# Altium project WiCAN.PrjPcb
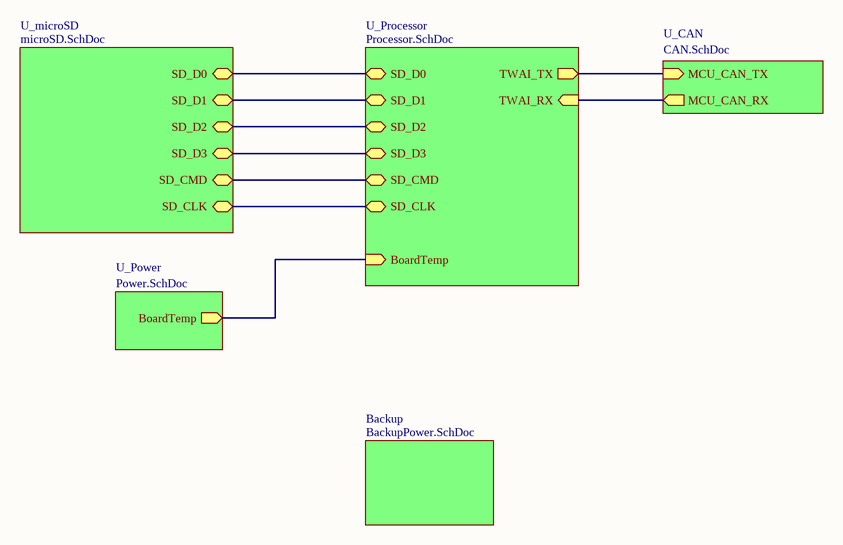
[diagram p0: WiCAN_master.SchDoc]
6 sheets, 95 parts. Net scope: hierarchical (ports join the sheet entries above them; power ports are global).
Board file: WiCAN_V2.PcbDoc
Sheets:
  WiCAN_master.SchDoc
    U_Processor = Processor.SchDoc
    U_Power = Power.SchDoc
    U_microSD = microSD.SchDoc
    U_CAN = CAN.SchDoc
    Backup = BackupPower.SchDoc

## Sheet WiCAN_master.SchDoc
size A4; SheetNumber: 1; SheetTotal: 6

### Sub-sheets
Backup = BackupPower.SchDoc: no entries
U_CAN = CAN.SchDoc: MCU_CAN_TX (in), MCU_CAN_RX (out)
U_microSD = microSD.SchDoc: SD_D0 (bidir), SD_D1 (bidir), SD_D2 (bidir), SD_D3 (bidir), SD_CMD (bidir), SD_CLK (bidir)
U_Power = Power.SchDoc: BoardTemp (out)
U_Processor = Processor.SchDoc: SD_D0 (bidir), SD_D1 (bidir), SD_D2 (bidir), SD_D3 (bidir), SD_CMD (bidir), SD_CLK (bidir), TWAI_TX (out), TWAI_RX (in), BoardTemp (in)

### Nets
MCU_Temp_In: sheet U_Processor/BoardTemp, sheet U_Power/BoardTemp
NetJ2_1: sheet U_Processor/SD_D2, sheet U_microSD/SD_D2
NetJ2_2: sheet U_Processor/SD_D3, sheet U_microSD/SD_D3
NetJ2_3: sheet U_Processor/SD_CMD, sheet U_microSD/SD_CMD
NetJ2_5: sheet U_Processor/SD_CLK, sheet U_microSD/SD_CLK
NetJ2_7: sheet U_Processor/SD_D0, sheet U_microSD/SD_D0
NetJ2_8: sheet U_Processor/SD_D1, sheet U_microSD/SD_D1
NetU1_20: sheet U_Processor/TWAI_TX, sheet U_CAN/MCU_CAN_TX
NetU1_21: sheet U_Processor/TWAI_RX, sheet U_CAN/MCU_CAN_RX

## Sheet Processor.SchDoc
size A4; SheetNumber: 2; SheetTotal: 6; SPICEModelCacheYJUROCZO: <root> / <DocumentId>YJUROCZO</DocumentId> / <CacheFrame Number="0"> / <Model Name="umk107bj105_a-t" Kind="CKT"> / <Text>* UMK107BJ105_A-T     SPICE MODEL  ( General Type ) / *-------------------------------------------------------------------------------------------------------- / * Model Generated by TAIYO YUDEN Corporation (http://www.ty-top.com) / * Version 1.0 / * TAIYO YUDEN Control No. 170508_130520 / * Copyright(c) 2012 TAIYO YUDEN CO.,LTD. All Rights Reserved. / *-------------------------------------------------------------------------------------------------------- / * / * Products Name : Multilayer Ceramic Capacitors / * / * Characteristics : / *     Capacitance : 1 uF , Rated Voltage : 50V , TCC : X5R / *     Case Size : 1.6 x 0.8 / 0.063 x 0.031 [mm/inch] , Thickness : 0.8 / 0.031 [mm/inch] / *     (Conditions: Temperature = 25 degC , DC Bias Current/Voltage = 0A / 0V) / * / * Frequency Range : 40Hz - 3GHz / * / * External Node Assignments : / * / *  1  o---| |---o  2 / * / *-------------------------------------------------------------------------------------------------------- / .SubCkt UMK107BJ105_A-T 1 2 / **************************** / C0 1 110 0.79929u / Cm 1 101 0.13681u / C1 101 102 0.26224u / Rc1 101 102 5.8806k / C2 102 103 0.057839u / Rc2 102 103 469.42 / C3 103 110 0.014568u / Rc3 103 110 14.853 / C2m 1 301 0.13283u / C21 301 302 1.2593u / Rc21 301 302 6.3079k / C22 302 303 1.1189u / Rc22 302 303 6.9405k / C23 303 304 1.1421u / Rc23 303 304 6.4848k / C24 304 305 0.36861u / Rc24 304 305 785 / C25 305 306 0.39327u / Rc25 305 306 637.41 / C26 306 307 0.27451u / Rc26 306 307 19.365 / C27 307 308 0.15295u / Rc27 307 308 23.239 / C28 308 309 0.17569u / Rc28 308 309 17.788 / C29 309 110 1420.6p / Rc29 309 110 1.9725 / Rp0 1 110 500Meg / L0 110 120 0.24088n / Lm 120 130 0.1369n / L1 120 121 0.1842n / RL1 121 130 0.29804 / L2 120 122 0.40657n / RL2 122 130 0.57395 / L3 120 123 0.85773n / RL3 123 130 0.82282 / CR 120 124 0.11463u / LR 124 125 0.25983n / RR 125 130 52.447m / CL 130 140 1.4637p / LL 130 140 0.23986n / RL 130 140 33.985 / Rs 140 2 6.8539m / **************************** / .ends UMK107BJ105_A-T</Text> / </Model> / </CacheFrame> / </root>
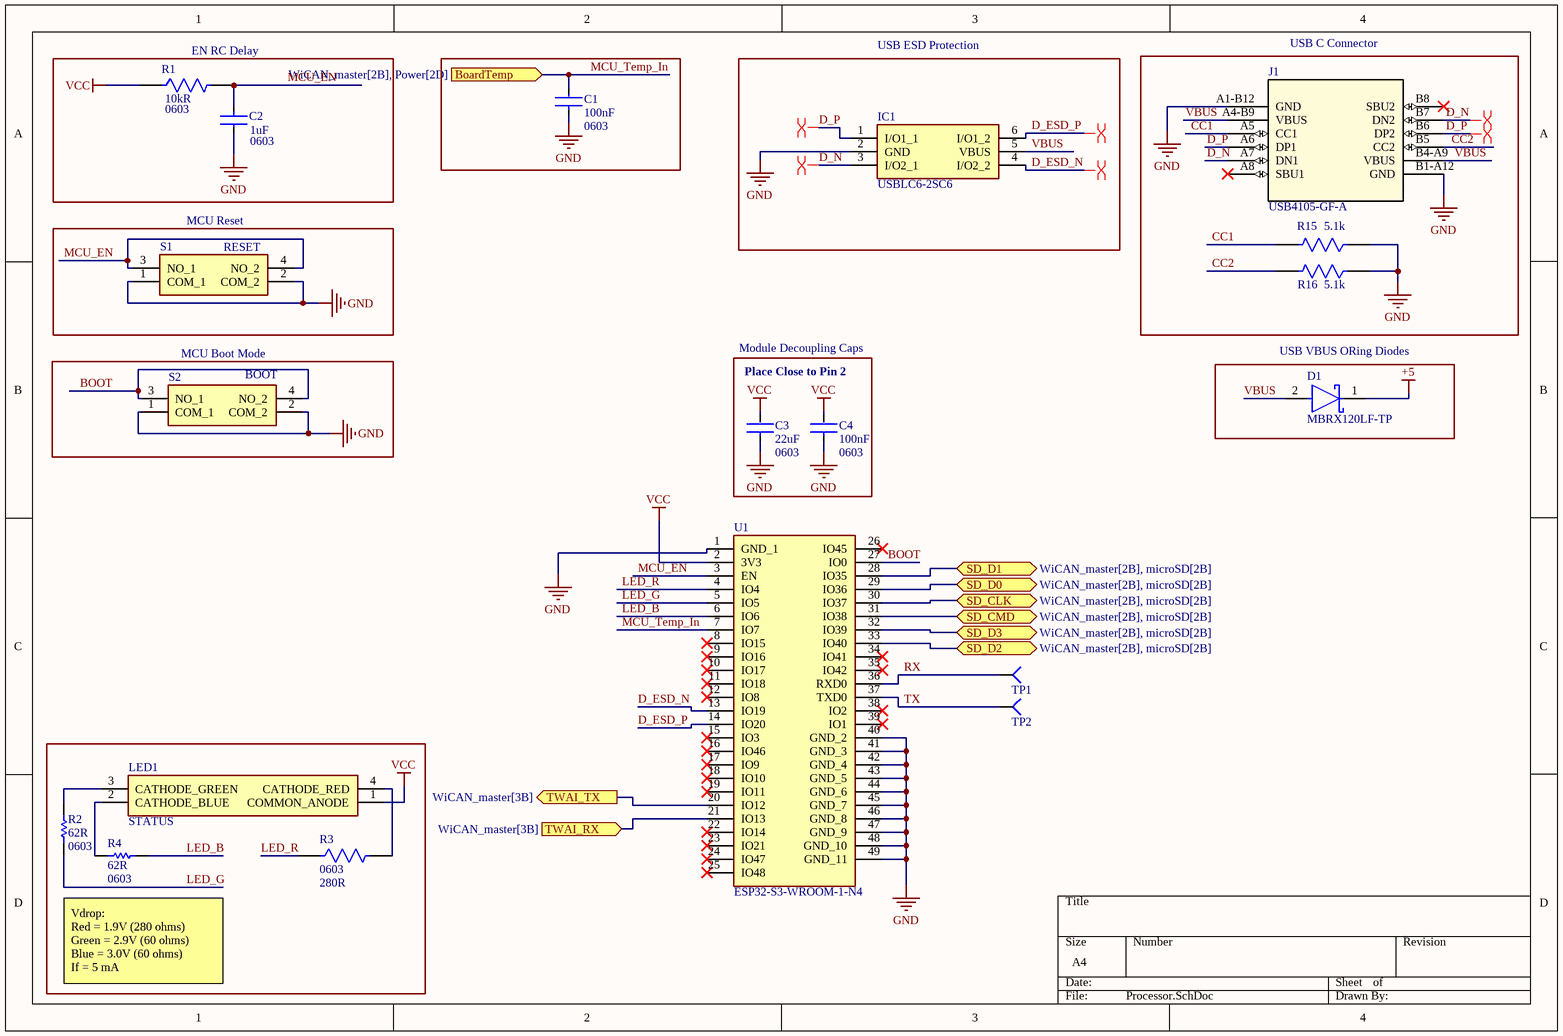
[diagram p1: Processor.SchDoc]

### Parts
C1  Capacitance: 100nF  Case/Package: 0603  [FP-CL10-IPC_A]  (hidden comment: CL10B104KB8WPNC)
C2  Case/Package: 0603  Capacitance: 1uF  [FP-0603-L_1_6_0_1-W_0_8_0-IPC_A]  (hidden comment: UMK107BJ105KA-T)
C3  Capacitance: 22uF  Case Code (Imperial): 0603  [FP-GRM188-0_2-IPC_C]  (hidden comment: GRM188R61A226ME15D)
C4  Capacitance: 100nF  Case/Package: 0603  [FP-CL10-IPC_A]  (hidden comment: CL10B104KB8WPNC)
D1  MBRX120LF-TP  [FP-SOD-123-IPC_A]
IC1  USBLC6-2SC6  [SOT95P280X145-6N]
J1  USB4105-GF-A  [USB4105_GCT]
LED1  STATUS  [CLMVCFKACL1D1L71BB7C3C3]
R1  Case Code (Imperial): 0603  Resistance: 10kR  [FP-RMCF0603-MFG]  (hidden comment: RMCF0603JG10K0)
R2  Resistance: 62R  Package: 0603  [RESC1608X55X30ML15T15]  (hidden comment: ERJ-3GEYJ620V)
R3  Case/Package: 0603  Resistance: 280R  [FP-RMCF0603-MFG]  (hidden comment: RMCF0603FT280R)
R4  Resistance: 62R  Package: 0603  [RESC1608X55X30ML15T15]  (hidden comment: ERJ-3GEYJ620V)
R15  Resistor: 5.1k  [FP-AC0603-MFG]  (hidden comment: AC0603FR-135K1L)
R16  Resistor: 5.1k  [FP-AC0603-MFG]  (hidden comment: AC0603FR-135K1L)
S1  RESET  [PTS526SM15SMTR2LFS]
S2  BOOT  [PTS526SM15SMTR2LFS]
TP1  RX  [TESTPOINT_CIRCLE_1MM]  (value not drawn)  (no BOM)
TP2  TX  [TESTPOINT_CIRCLE_1MM]  (value not drawn)  (no BOM)
U1  ESP32-S3-WROOM-1-N4  [ESP32S3WROOM1N4]

### Blocks framed on the sheet
EN RC Delay: C2 R1
USB ESD Protection: IC1
USB C Connector: J1 R15 R16
MCU Reset: S1
MCU Boot Mode: S2
USB VBUS ORing Diodes: D1

### Ports
BoardTemp (in, see WiCAN_master[2B], Power[2D]), SD_CLK (bidir, see WiCAN_master[2B], microSD[2B]), SD_CMD (bidir, see WiCAN_master[2B], microSD[2B]), SD_D0 (bidir, see WiCAN_master[2B], microSD[2B]), SD_D1 (bidir, see WiCAN_master[2B], microSD[2B]), SD_D2 (bidir, see WiCAN_master[2B], microSD[2B]), SD_D3 (bidir, see WiCAN_master[2B], microSD[2B]), TWAI_RX (in, see WiCAN_master[3B]), TWAI_TX (out, see WiCAN_master[3B])

### Nets
+5: D1.1(C)
GND: C1.1 C2.2 C3.1 C4.1 IC1.2(GND) J1.A1-B12(GND) J1.B1-A12(GND) R15.1 R16.1 S1.1(COM_1) S1.2(COM_2) S2.1(COM_1) S2.2(COM_2) U1.1(GND_1) U1.40(GND_2) U1.41(GND_3) U1.42(GND_4) U1.43(GND_5) U1.44(GND_6) U1.45(GND_7) U1.46(GND_8) U1.47(GND_9) U1.48(GND_10) U1.49(GND_11)
VCC: C3.2 C4.2 LED1.1(COMMON_ANODE) R1.1 U1.2(3V3)
BOOT: S2.3(NO_1) S2.4(NO_2) U1.27(IO0)
CC1: J1.A5(CC1) R15.2
CC2: J1.B5(CC2) R16.2
D_ESD_N: IC1.4(I/O2_2) U1.13(IO19)
D_ESD_P: IC1.6(I/O1_2) U1.14(IO20)
D_N: IC1.3(I/O2_1) J1.A7(DN1) J1.B7(DN2)
D_P: IC1.1(I/O1_1) J1.A6(DP1) J1.B6(DP2)
LED_B: R4.2 U1.6(IO6)
LED_G: R2.2 U1.5(IO5)
LED_R: R3.1 U1.4(IO4)
MCU_EN: C2.1 R1.2 S1.3(NO_1) S1.4(NO_2) U1.3(EN)
MCU_Temp_In: C1.2 U1.7(IO7) ; port BoardTemp
RX: TP1.1(=value) U1.36(RXD0)
TX: TP2.1(=value) U1.37(TXD0)
VBUS: D1.2(A) IC1.5(VBUS) J1.A4-B9(VBUS) J1.B4-A9(VBUS)
NetJ2_1: U1.33(IO40) ; port SD_D2
NetJ2_2: U1.32(IO39) ; port SD_D3
NetJ2_3: U1.31(IO38) ; port SD_CMD
NetJ2_5: U1.30(IO37) ; port SD_CLK
NetJ2_7: U1.29(IO36) ; port SD_D0
NetJ2_8: U1.28(IO35) ; port SD_D1
NetLED1_2: LED1.2(CATHODE_BLUE) R4.1
NetLED1_3: LED1.3(CATHODE_GREEN) R2.1
NetLED1_4: LED1.4(CATHODE_RED) R3.2
NetU1_20: U1.20(IO12) ; port TWAI_TX
NetU1_21: U1.21(IO13) ; port TWAI_RX

Not connected (* = marked no-connect by the designer): J1 A8(SBU1)* B8(SBU2)*; U1 8(IO15)* 9(IO16)* 10(IO17)* 11(IO18)* 12(IO8)* 15(IO3)* 16(IO46)* 17(IO9)* 18(IO10)* 19(IO11)* 22(IO14)* 23(IO21)* 24(IO47)* 25(IO48)* 26(IO45)* 34(IO41)* 35(IO42)* 38(IO2)* 39(IO1)*

### Layout directives
differential pair: D_ESD_N, D_ESD_P, D_N, D_P

### Notes on the sheet
- Module Decoupling Caps
- Place Close to Pin 2
- Vdrop:
  Red = 1.9V (280 ohms)
  Green = 2.9V (60 ohms)
  Blue = 3.0V (60 ohms)
  If = 5 mA

### Library data of the parts
C1 C4 = CMP-13271-002353-1: Cap Ceramic 100nF 50V X7R ±10% Pad SMD 0603 +125°C T/R; Ratings: AEC-Q200; Features: Soft Termination; Max Operating Temperature: 125°C; Mount: Surface Mount; Width: 0.031inch; Voltage Rating: 50V; Case Code (Metric): 1608; Case Code (Imperial): 0603; Tolerance: 10%; Min Operating Temperature: -55°C; Thickness: 0.035inch; Lead Free: Lead Free; Packaging: Tape and Reel; Length: 0.063inch
C2 = CMP-2000-05447-3: None; Tolerance: 10%; Voltage Rating: 50V; Dielectric: X5R; Height: 0.8mm; Depth: 0.8mm; Number of Pins: 2; Length: 1.6mm; Thickness: 0.035inch; Contact Plating: Nickel; Radiation Hardening: No; Package Quantity: 1; Halogen Free: Halogen Free; RoHS Compliant: Yes; Termination: SMD/SMT; Max Operating Temperature: 85°C; Min Operating Temperature: -55°C; Case Code (Metric): 1608; Construction: Flat; Voltage Rating (DC): 50V; Packaging: Tape and Reel; Series: M; Case Code (Imperial): 0603; Width: 0.031inch; Mount: Surface Mount
C3 = CMP-2000-06337-3: Chip Multilayer Ceramic Capacitors for General Purpose, 0603, 22uF, X5R, 15%, 20%, 10V; Tolerance: 20%; Weight: 0.000222oz; Material: Ceramic; Depth: 0.8mm; Length: 1.6mm; Termination: SMD/SMT; Packaging: Tape and Reel; Width: 0.8mm; Voltage Rating: 10V; Mount: Surface Mount; Voltage Rating (DC): 10V; Case/Package: 0603; Thickness: 0.039inch; REACH SVHC: No SVHC; Dielectric: X5R; Height: 0.8mm; Package Quantity: 4000; Case Code (Metric): 1608; Min Operating Temperature: -55°C; Lead Free: Lead Free; Max Operating Temperature: 85°C
D1 = CMP-56206-000012-1: DIODE SCHOTTKY 20V 1A SOD123; Max Power Dissipation: 556mW; Forward Voltage: 360mV; Peak Non-Repetitive Surge Current: 12A; Element Configuration: Single; Max Reverse Voltage (DC): 20V; Lead Free: Lead Free; Max Operating Temperature: 125°C; Radiation Hardening: No; Mount: Surface Mount; Number of Pins: 2; Average Rectified Current: 1A; Min Operating Temperature: -65°C; Max Repetitive Reverse Voltage (Vrrm): 20V; RoHS Compliant: Yes; Package Quantity: 1; Max Forward Surge Current (Ifsm): 12A; Packaging: Tape and Reel; Max Surge Current: 12A; Forward Current: 1A
IC1 = USBLC6-2SC6: Integrated Circuit; Manufacturer_Name: STMicroelectronics; Datasheet Link: http://www.st.com/st-web-ui/static/active/en/resource/technical/document/datasheet/CD00050750.pdf; Height: 1.45mm; Manufacturer_Part_Number: USBLC6-2SC6; Mouser Part Number: 511-USBLC6-2SC6; Mouser Price/Stock: https://www.mouser.co.uk/ProductDetail/STMicroelectronics/USBLC6-2SC6?qs=po45yt2pPpu%2FhNIlwQdTlg%3D%3D; Arrow Part Number: USBLC6-2SC6; Arrow Price/Stock: https://www.arrow.com/en/products/usblc6-2sc6/stmicroelectronics?region=nac
J1 = USB4105-GF-A: No Description Available; Mfr_Name: Global Connector Technology; Copyright: Copyright (C) 2022 Ultra Librarian. All rights reserved.; Manufacturer_Part_Number: USB4105-GF-A; Digi-Key_Part_Number_1: 2073-USB4105-GF-ACT-ND; Digi-Key_Part_Number_2: 2073-USB4105-GF-ADKR-ND; Digi-Key_Part_Number_3: 2073-USB4105-GF-ATR-ND; RefDes: RefDes; Type: DEV
LED1 = CLMVC-FKA-CL1D1L71BB7C3C3: LED; Manufacturer_Name: Wolfspeed; Datasheet Link: https://www.cree.com/led-components/media/documents/1273-CLMVC-FKA.pdf; Height: 1mm; Manufacturer_Part_Number: CLMVC-FKA-CL1D1L71BB7C3C3; Mouser Part Number: 941-CLMVCFKACL1D1L71; Mouser Price/Stock: https://www.mouser.co.uk/ProductDetail/Cree-LED/CLMVC-FKA-CL1D1L71BB7C3C3?qs=fSnNYG2PaKLJAXXrLOgMiQ%3D%3D; Arrow Part Number: CLMVC-FKA-CL1D1L71BB7C3C3; Arrow Price/Stock: https://www.arrow.com/en/products/clmvc-fka-cl1d1l71bb7c3c3/cree-led?region=nac
R1 = CMP-26527-000153-1: 10kΩ ±5% 0.1W 0603 Thick Film Chip Resistor AEC-Q200 compliant; Temperature Coefficient: 200ppm/°C; Max Power Dissipation: 100mW; Tolerance: 5%; Series: RMCF; Resistor Type: Thick Film; Length: 0.061inch; Features: Automotive AEC-Q200; Height: 0.022inch; Case Code (Metric): 1608; Width: 0.031inch; Number of Terminations: 2; Contact Plating: Tin; Case/Package: 0603; Package Quantity: 1; Max Operating Temperature: 155°C; Mount: Surface Mount; RoHS Compliant: Yes; Radiation Hardening: No; Min Operating Temperature: -55°C; Packaging: Tape and Reel
R2 R4 = CMP-1012-00045-2: Manufacturer: Panasonic; Part Number: ERJ-3GEYJ620V
R3 = CMP-26527-006784-1: 280Ω ±1% 0.1W 0603 Thick Film Chip Resistor AEC-Q200 compliant; Max Power Dissipation: 100mW; Temperature Coefficient: 100ppm/°C; RoHS Compliant: Yes; Height: 0.022inch; Resistor Type: Thick Film; Case Code (Metric): 1608; Radiation Hardening: No; Contact Plating: Tin; Series: RMCF; Features: Automotive AEC-Q200; Number of Terminations: 2; Tolerance: 1%; Packaging: Tape and Reel; Max Operating Temperature: 155°C; Min Operating Temperature: -55°C; Length: 0.061inch; Lead Free: Lead Free; Width: 0.031inch; Mount: Surface Mount; Case Code (Imperial): 0603
R15 R16 = CMP-03412-003579-2: RES 5.1KΩ 1.00% 0.1W 0603; RoHS Compliant: Yes
S1 S2 = PTS526_SM15_SMTR2_LFS: Switch; Manufacturer_Name: C & K COMPONENTS; Manufacturer_Part_Number: PTS526 SM15 SMTR2 LFS; Datasheet Link: https://www.mouser.com/datasheet/2/60/pts526-1651200.pdf; Height: 1.5mm; Mouser Part Number: 611-PTS526SM15SMTR2L; Mouser Price/Stock: https://www.mouser.co.uk/ProductDetail/CK/PTS526-SM15-SMTR2-LFS?qs=UXgszm6BlbENivbslIA%252B5g%3D%3D; Arrow Part Number: PTS526 SM15 SMTR2 LFS; Arrow Price/Stock: https://www.arrow.com/en/products/pts526-sm15-smtr2-lfs/ck?region=nac
TP1 TP2 = TESTPOINT_1MM_CIRCLE: TESTPOINT 1MM CIRCLE; Part Number (MPN): *
U1 = ESP32-S3-WROOM-1-N4: Integrated Circuit; Manufacturer_Name: Espressif Systems; Datasheet Link: https://www.espressif.com/sites/default/files/documentation/esp32-s3-wroom-1_wroom-1u_datasheet_en.pdf; Height: 3.25mm; Manufacturer_Part_Number: ESP32-S3-WROOM-1-N4; Mouser Part Number: 356-ESP32-S3WROOM1N4; Mouser Price/Stock: https://www.mouser.co.uk/ProductDetail/Espressif-Systems/ESP32-S3-WROOM-1-N4?qs=Li%252BoUPsLEnsO%2FkiJOUK0FQ%3D%3D

## Sheet Power.SchDoc
size A4; SheetNumber: 3; SheetTotal: 6
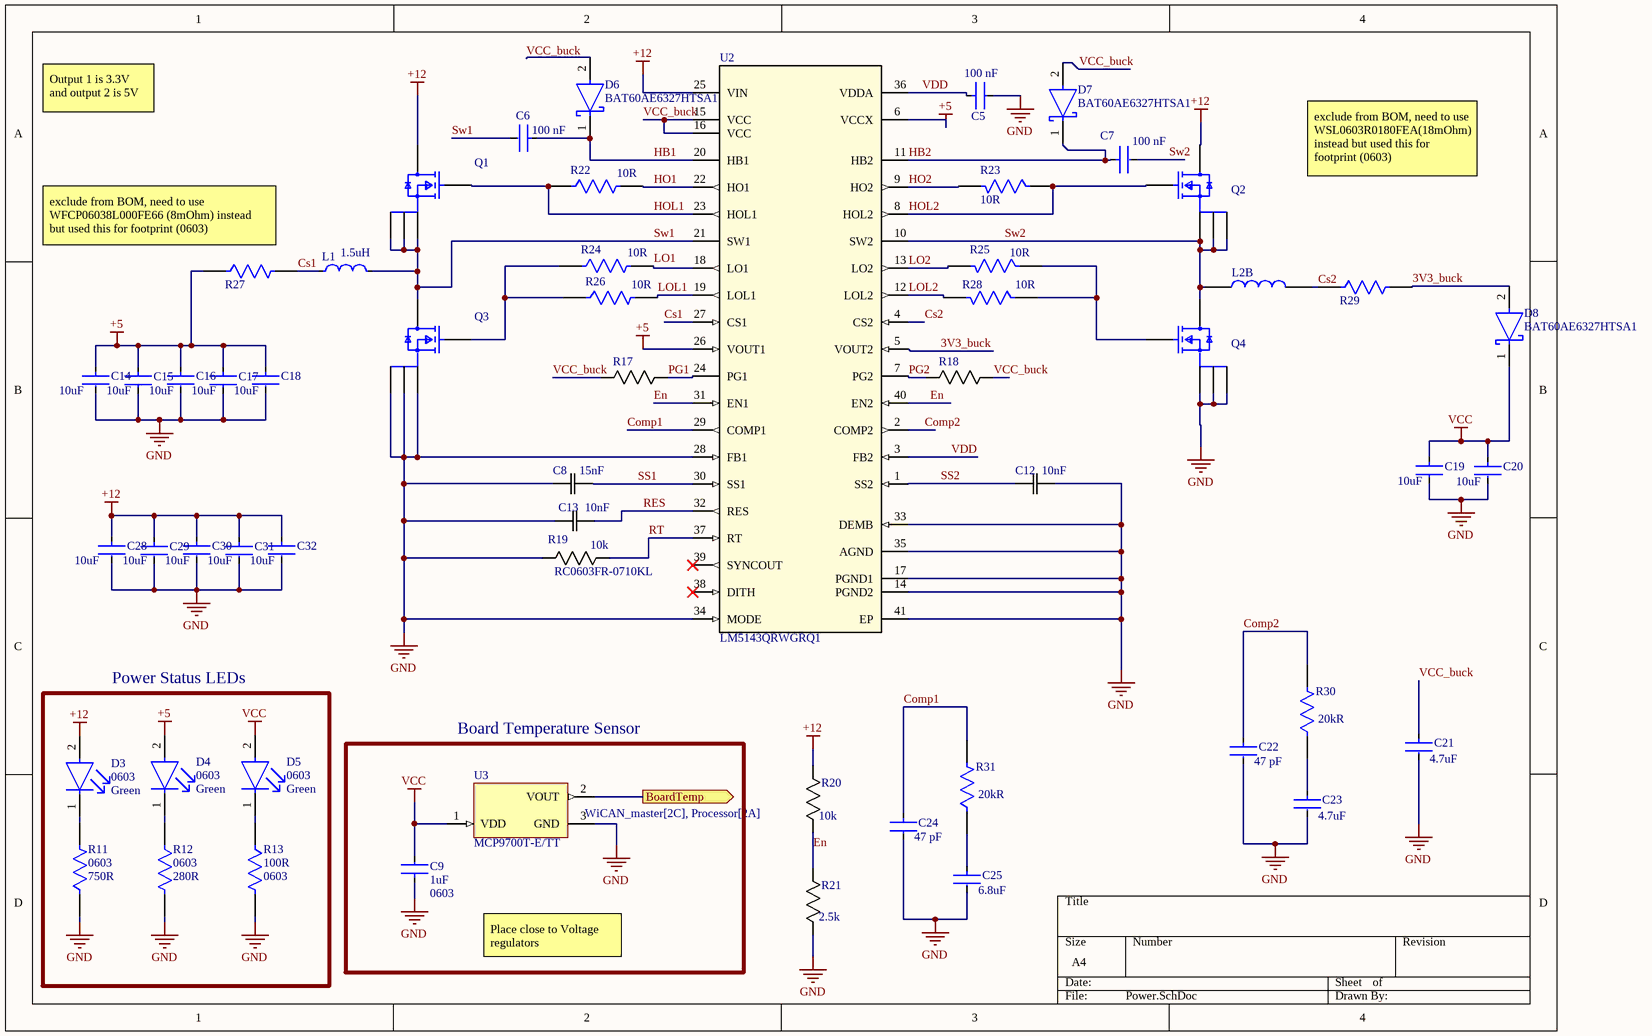
[diagram p2: Power.SchDoc]

### Parts
C5  Capacitance: 100 nF  [FP-CC0603-DA-MFG]  (hidden comment: CC0603KRX7R8BB104)
C6  Capacitance: 100 nF  [FP-CC0603-DA-MFG]  (hidden comment: CC0603KRX7R8BB104)
C7  Capacitance: 100 nF  [FP-CC0603-DA-MFG]  (hidden comment: CC0603KRX7R8BB104)
C8  Capacitance: 15nF  [CAPC17595_87N_KEM]  (hidden comment: C0603C153K5RACTU)
C9  Capacitance: 1uF  Case Code (Imperial): 0603  [FP-CL10-IPC_A]  (hidden comment: CL10A105KO8NNNC)
C12  Capacitance: 10nF  [CAPC17595_87N_KEM]  (hidden comment: C0603C153K5RACTU)
C13  Capacitance: 10nF  [CAPC17595_87N_KEM]  (hidden comment: C0603C103K5RACTU)
C14  Capacitance: 10uF  [FP-GRM188-0_15-MFG]  (hidden comment: GRM188R61A106ME69D)
C15  Capacitance: 10uF  [FP-GRM188-0_15-MFG]  (hidden comment: GRM188R61A106ME69D)
C16  Capacitance: 10uF  [FP-GRM188-0_15-MFG]  (hidden comment: GRM188R61A106ME69D)
C17  Capacitance: 10uF  [FP-GRM188-0_15-MFG]  (hidden comment: GRM188R61A106ME69D)
C18  Capacitance: 10uF  [FP-GRM188-0_15-MFG]  (hidden comment: GRM188R61A106ME69D)
C19  Capacitance: 10uF  [FP-GRM188-0_15-MFG]  (hidden comment: GRM188R61A106ME69D)
C20  Capacitance: 10uF  [FP-GRM188-0_15-MFG]  (hidden comment: GRM188R61A106ME69D)
C21  Capacitance: 4.7uF  [FP-GRM188-0_15-IPC_C]  (hidden comment: GRM188R61E475KE11D)
C22  Capacitance: 47 pF  [FP-C0603C-CF-MFG]  (hidden comment: C0603C470J5GACTU)
C23  Capacitance: 4.7uF  [FP-GRM188-0_15-IPC_C]  (hidden comment: GRM188R61E475KE11D)
C24  Capacitance: 47 pF  [FP-C0603C-CF-MFG]  (hidden comment: C0603C470J5GACTU)
C25  Capacitance: 6.8uF  [FP-C1608-080-0_1-IPC_B]  (hidden comment: C1608X5R1A685M080AC)
C28  Capacitance: 10uF  [FP-GRM188-0_15-MFG]  (hidden comment: GRM188R61A106ME69D)
C29  Capacitance: 10uF  [FP-GRM188-0_15-MFG]  (hidden comment: GRM188R61A106ME69D)
C30  Capacitance: 10uF  [FP-GRM188-0_15-MFG]  (hidden comment: GRM188R61A106ME69D)
C31  Capacitance: 10uF  [FP-GRM188-0_15-MFG]  (hidden comment: GRM188R61A106ME69D)
C32  Capacitance: 10uF  [FP-GRM188-0_15-MFG]  (hidden comment: GRM188R61A106ME69D)
D3  Case Code (Imperial): 0603  Color: Green  [FP-LTST-C190KGKT-MFG]  (hidden comment: 12V)
D4  Case Code (Imperial): 0603  Color: Green  [FP-LTST-C190KGKT-MFG]  (hidden comment: 5V)
D5  Case Code (Imperial): 0603  Color: Green  [FP-LTST-C190KGKT-MFG]  (hidden comment: 3V3)
D6  BAT60AE6327HTSA1  [FP-PG-SOD323-2-IPC_C]
D7  BAT60AE6327HTSA1  [FP-PG-SOD323-2-IPC_C]
D8  BAT60AE6327HTSA1  [FP-PG-SOD323-2-IPC_C]
L1  value 1.5uH  [FP-PCC-M0530M-LP-MFG]  (hidden comment: ETQP3M1R5KVP)
L2  CDRH104RNP-2R5NC  [CDRH104RNP-2R5NC]  (value not drawn)  (part B of 2)
Q1  CSD17579Q3A  [FP-DNH0008A-MFG]  (value not drawn)
Q2  CSD17579Q3A  [FP-DNH0008A-MFG]  (value not drawn)
Q3  CSD17579Q3A  [FP-DNH0008A-MFG]  (value not drawn)
Q4  CSD17579Q3A  [FP-DNH0008A-MFG]  (value not drawn)
R11  Case/Package: 0603  Resistance: 750R  [FP-ESR03-IPC_B]  (hidden comment: ESR03EZPJ751)
R12  Case/Package: 0603  Resistance: 280R  [FP-RMCF0603-MFG]  (hidden comment: RMCF0603FT280R)
R13  Resistance: 100R  Case/Package: 0603  [FP-AC0603-IPC_A]  (hidden comment: AC0603FR-10100RL)
R17  RC0603FR-0710KL  [RC0603N_YAG]  (value not drawn)
R18  RC0603FR-0710KL  [RC0603N_YAG]  (value not drawn)
R19  RC0603FR-0710KL  R: 10k  [RC0603N_YAG]
R20  R: 10k  [RC0603N_YAG]  (hidden comment: RC0603FR-0710KL)
R21  R: 2.5k  [RES_RNCF0603_STP]  (hidden comment: RNCF0603BTE2K50)
R22  Resistance: 10R  [FP-RMCF0603-MFG]  (hidden comment: RMCF0603FT10R0)
R23  Resistance: 10R  [FP-RMCF0603-MFG]  (hidden comment: RMCF0603FT10R0)
R24  Resistance: 10R  [FP-RMCF0603-MFG]  (hidden comment: RMCF0603FT10R0)
R25  Resistance: 10R  [FP-RMCF0603-MFG]  (hidden comment: RMCF0603FT10R0)
R26  Resistance: 10R  [FP-RMCF0603-MFG]  (hidden comment: RMCF0603FT10R0)
R27  MCT0603MD4021BP100  [FP-MCT0603-MFG]  (value not drawn)
R28  Resistance: 10R  [FP-RMCF0603-MFG]  (hidden comment: RMCF0603FT10R0)
R29  MCT0603MD4021BP100  [FP-MCT0603-MFG]  (value not drawn)
R30  Resistance: 20kR  [FP-RC0603-0_55-IPC_C]  (hidden comment: RC0603FR-0720KL)
R31  Resistance: 20kR  [FP-RC0603-0_55-IPC_C]  (hidden comment: RC0603FR-0720KL)
U2  LM5143QRWGRQ1  [RWG0040A]
U3  MCP9700T-E/TT  [SOT-23-TT3_M]

### Blocks framed on the sheet
Power Status LEDs: D3-D5 R11-R13
Board Temperature Sensor: C9 U3

### Ports
BoardTemp (out, see WiCAN_master[2C], Processor[2A])

### Nets
+5: C14.1 C15.1 C16.1 C17.1 C18.1 D4.2(A) R27.1 U2.6(VCCX) U2.26(VOUT1)
+12: C28.1 C29.1 C30.1 C31.1 C32.1 D3.2(A) Q1.5-6-7-8(D) Q2.5-6-7-8(D) R20.2 U2.25(VIN)
GND: C5.2 C8.1 C9.1 C12.2 C13.1 C14.2 C15.2 C16.2 C17.2 C18.2 C19.2 C20.2 C21.2 C22.2 C23.2 C24.2 C25.1 C28.2 C29.2 C30.2 C31.2 C32.2 Q3.1(S) Q3.2(S) Q3.3(S) Q4.1(S) Q4.2(S) Q4.3(S) R11.1 R12.2 R13.2 R19.1 R21.1 U2.14(PGND2) U2.17(PGND1) U2.28(FB1) U2.33(DEMB) U2.34(MODE) U2.35(AGND) U2.41(EP) U3.3(GND)
VCC: C9.2 C19.1 C20.1 D5.2(A) D8.1(C) U3.1(VDD)
3V3_buck: D8.2(A) R29.2 U2.5(VOUT2)
Comp1: C24.1 R31.2 U2.29(COMP1)
Comp2: C22.1 R30.2 U2.2(COMP2)
Cs1: L1.1 R27.2 U2.27(CS1)
Cs2: L2.2 R29.1 U2.4(CS2)
En: R20.1 R21.2 U2.31(EN1) U2.40(EN2)
HB1: C6.1 D6.1(C) U2.20(HB1)
HB2: C7.1 D7.1(C) U2.11(HB2)
HO1: R22.2 U2.22(HO1)
HO2: R23.2 U2.9(HO2)
HOL1: Q1.4(G) R22.1 U2.23(HOL1)
HOL2: Q2.4(G) R23.1 U2.8(HOL2)
LO1: R24.2 U2.18(LO1)
LO2: R25.2 U2.13(LO2)
LOL1: R26.2 U2.19(LOL1)
LOL2: R28.2 U2.12(LOL2)
MCU_Temp_In: U3.2(VOUT) ; port BoardTemp
PG1: R17.2 U2.24(PG1)
PG2: R18.1 U2.7(PG2)
RES: C13.2 U2.32(RES)
RT: R19.2 U2.37(RT)
SS1: C8.2 U2.30(SS1)
SS2: C12.1 U2.1(SS2)
Sw1: C6.2 L1.2 Q1.1(S) Q1.2(S) Q1.3(S) Q3.5-6-7-8(D) U2.21(SW1)
Sw2: C7.2 L2.1 Q2.1(S) Q2.2(S) Q2.3(S) Q4.5-6-7-8(D) U2.10(SW2)
VCC_buck: C21.1 D6.2(A) D7.2(A) R17.1 R18.2 U2.15(VCC) U2.16(VCC)
VDD: C5.1 U2.3(FB2) U2.36(VDDA)
NetC23_1: C23.1 R30.1
NetC25_2: C25.2 R31.1
NetD3_1: D3.1(C) R11.2
NetD4_1: D4.1(C) R12.1
NetD5_1: D5.1(C) R13.1
NetQ3_4: Q3.4(G) R24.1 R26.1
NetQ4_4: Q4.4(G) R25.1 R28.1

Not connected (* = marked no-connect by the designer): U2 38(DITH)* 39(SYNCOUT)*

### Notes on the sheet
- Output 1 is 3.3V and output 2 is 5V
- exclude from BOM, need to use WSL0603R0180FEA(18mOhm) instead but used this for footprint (0603)
- (near R27) exclude from BOM, need to use WFCP06038L000FE66 (8mOhm) instead but used this for footprint (0603)
- Place close to Voltage regulators

### Library data of the parts
C5-C7 = CMP-03422-000234-1: CAP CER 0.1UF 25V X7R 0603; Manufacturer: YAGEO; Tolerance: 0.1; Temperature Coefficient: 15%; Material: Ceramic; Value: 100 nF; Category: Cap; ComponentLink2URL: http://www.yageo.com/documents/recent/UPY-GPHC_X7R_6.3V-to-50V_18.pdf; Voltage Rating: 25 V; ComponentLink2Description: Datasheet; RoHS: TRUE; Octopart: https://octopart.com/cc0603krx7r8bb104-yageo-8376534; Manufacturer Part Number: CC0603KRX7R8BB104; Mouser Description: CC Series 0603 0.1 uF 25 V ±10% Tolerance X7R SMT Multilayer Ceramic Capacitor; Device Class L2: Capacitors; Automotive: No; Temperature Range Low: -55°C; Lead Free: Yes; Temperature Range High: +125°C; Package: CC0603-DA; Temperature: -55°C to +125°C; Footprint Url: http://www.yageo.com/exep/pages/download/literatures/UPY-C_GEN_24.pdf; Height: 0.9mm; Voltage: 25 V; Temperature Characteristic: X7R; Device Class L3: Ceramic Capacitors; Digikey Description: CAP CER 0.1UF 25V X7R 0603; Device Class L1: Passive Components
C8 C12 = C0603C153K5RACTU: SMD Comm X7R, Ceramic, 0.015 uF, 10%, 50 VDC, X7R, SMD, MLCC, Temperature Stable, Class II, 0603; Manufacturer_Name: Kemet; Copyright: Copyright (C) 2026 Ultra Librarian. All rights reserved.; Manufacturer_Part_Number: C0603C153K5RACTU; Datasheet: https://content.kemet.com/datasheets/KEM_C1002_X7R_SMD.pdf; Digi-Key_Part_Number_1: 399-7860-2-ND; Digi-Key_Part_Number_2: 399-7860-1-ND; Digi-Key_Part_Number_3: 399-7860-6-ND
C9 = CMP-13271-001457-1: Cap Ceramic 1uF 16V X5R ±10% Pad SMD 0603 +85°C T/R; Dielectric: X5R; Height: 0.8mm; Mount: Surface Mount; Thickness: 0.035inch; Width: 0.031inch; Min Operating Temperature: -55°C; Contact Plating: Tin; Depth: 0.8mm; Length: 1.6mm; Max Operating Temperature: 85°C; Packaging: Tape and Reel; Tolerance: 10%; Radiation Hardening: No; Case/Package: 0603; Package Quantity: 1; Voltage Rating: 16V; Case Code (Metric): 1608; Voltage: 16V; Material: Ceramic; Lead Free: Lead Free; Voltage Rating (DC): 16V
C13 = C0603C103K5RACTU: SMD Comm X7R, Ceramic, 0.01 uF, 10%, 50 VDC, X7R, SMD, MLCC, Temperature Stable, Class II, 0603; Manufacturer_Name: Kemet; Copyright: Copyright (C) 2025 Ultra Librarian. All rights reserved.; Manufacturer_Part_Number: C0603C103K5RACTU
C14-C20 C28-C32 = CMP-06035-003612-1: Chip Multilayer Ceramic Capacitors for General Purpose, 0603, 10uF, X5R, 15%, 20%, 10V; Tolerance: 20%; Dielectric: X5R; Package Quantity: 4000; Width: 0.8mm; Case/Package: 0603; Thickness: 0.035inch; Voltage Rating: 10V; Voltage Rating (DC): 10V; Termination: SMD/SMT; Length: 1.6mm; Lead Free: Lead Free; Mount: Surface Mount; Height: 0.8mm; Depth: 0.8mm; Packaging: Tape and Reel; Weight: 0.000222oz; Min Operating Temperature: -55°C; Case Code (Metric): 1608; Max Operating Temperature: 85°C; Case Code (Imperial): 0603; Material: Ceramic
C21 C23 = CMP-2006-02523-2: Chip Multilayer Ceramic Capacitors for General Purpose, 0603, 4.7uF, X5R, 15%, 10%, 25V; Case Code (Metric): 1608; Max Operating Temperature: 85°C; REACH SVHC: No SVHC; Voltage Rating: 25V; Dielectric: X5R; Packaging: Cut Tape; Width: 0.031inch; Min Operating Temperature: -55°C; Lead Free: Lead Free; Height: 0.8mm; Case Code (Imperial): 0603; Length: 1.6mm; Voltage Rating (DC): 25V; Case/Package: 0603; Voltage: 25V; Tolerance: 10%; Thickness: 0.031inch; Mount: Surface Mount; Material: Ceramic; Package Quantity: 4000; Depth: 0.8mm
C22 C24 = CMP-1035-01063-3: CAP CER 47PF 50V C0G/NP0 0603; Manufacturer: KEMET; Automotive Grade: Grade 1; Material: Ceramic; Tolerance: 0.05; Temperature Coefficient: 30ppm/°C; Temperature Characteristic: C0G; Manufacturer Part Number: C0603C470J5GACTU; Package: C0603C-CF; Device Class L2: Capacitors; Height: 0.87mm; Automotive: Yes; Device Class L3: Ceramic Capacitors; RoHS: TRUE; Category: Cap; Digikey Description: CAP CER 47PF 50V C0G/NP0 0603; Octopart: https://octopart.com/c0603c470j5gactu-kemet-96565; Mouser Description: Capacitor; Ceramic; Cap; 47.0pF; Tol+5%; SMT; Vol-Rtg 50V; C0G; TR; Value: 47 pF; ComponentLink2Description: Datasheet; Voltage Rating: 50 V; Lead Free: Yes; Temperature Range Low: -55°C; ComponentLink2URL: https://api.kemet.com/component-edge/download/datasheet/C0603C100J5GACAUTO.pdf; Device Class L1: Passive Components; Temperature Range High: +125°C; Temperature: -55°C to +125°C
C25 = CMP-08246-003434-1: Multilayer Ceramic Capacitors 6.8μF ±20% 10V X5R SMD 0603; Termination: SMD/SMT; Min Operating Temperature: -55°C; Case/Package: 0603; Lead Free: Lead Free; Max Operating Temperature: 85°C; RoHS Compliant: Yes; Series: C; Dielectric Material: Ceramic; Case Code (Metric): 1608; Width: 0.031inch; Packaging: Tape and Reel; Thickness: 0.035inch; Voltage Rating (DC): 10V; Case Code (Imperial): 0603; Depth: 0.8mm; Voltage Rating: 10V; Weight: 7.1E-05oz; Mount: Surface Mount; Tolerance: 20%; Height: 0.8mm; Package Quantity: 1; Length: 1.6mm; Dielectric: X5R; Construction: Flat
D3 D5 = CMP-2000-05197-2: LED GREEN CLEAR CHIP SMD; Test Current: 20mA; Power Rating: 75mW; Forward Voltage: 2V; Wavelength: 574nm; Number of LEDs: 1; Reverse Voltage: 5V; Dominant Wavelength: 571nm; Lens Style: Diffused; Luminous Intensity: 35mcd; Forward Current: 30mA; Viewing Angle: 130°; Lens Color: Colorless; Width: 0.8mm; Case Code (Metric): 1608; Number of Pins: 2; Radiation Hardening: No; Package Quantity: 1; Lead Free: Lead Free; Lens Transparency: Clear; Depth: 0.8mm; Power Dissipation: 75mW; Mount: Surface Mount; Max Operating Temperature: 85°C; Case/Package: 0603; Height: 0.8mm; Illumination Color: Green; Length: 1.6mm; Packaging: Tape and Reel; Number of Elements: 1; Min Operating Temperature: -55°C
D4 = CMP-2000-05197-2: LED GREEN CLEAR CHIP SMD; Test Current: 20mA; Power Rating: 75mW; Forward Voltage: 2V; Wavelength: 574nm; Number of LEDs: 1; Dominant Wavelength: 571nm; Lens Style: Diffused; Luminous Intensity: 35mcd; Forward Current: 30mA; Viewing Angle: 130°; Lens Color: Colorless; Width: 0.8mm; Case Code (Metric): 1608; Number of Pins: 2; Radiation Hardening: No; Package Quantity: 1; Lead Free: Lead Free; Lens Transparency: Clear; Depth: 0.8mm; Power Dissipation: 75mW; Reverse Voltage: 5V; Mount: Surface Mount; Max Operating Temperature: 85°C; Case/Package: 0603; Height: 0.8mm; Illumination Color: Green; Length: 1.6mm; Packaging: Tape and Reel; Number of Elements: 1; Min Operating Temperature: -55°C
D6-D8 = CMP-32890-000004-1: DIODE SCHOTTKY 10V 3A SOD323-2; Forward Voltage: 370mV; Polarity: Standard; Peak Non-Repetitive Surge Current: 5A; Element Configuration: Single; Max Operating Temperature: 85°C; Current Rating: 3A; Number of Pins: 2; Mount: Surface Mount; Forward Current: 3A; Max Reverse Voltage (DC): 10V; Output Current: 3A; Contact Plating: Tin; Average Rectified Current: 3A; Lead Free: Lead Free; Max Repetitive Reverse Voltage (Vrrm): 10V; Voltage Rating (DC): 10V; Radiation Hardening: No; Halogen Free: Not Halogen Free; Case/Package: SOD-323-2; REACH SVHC: No SVHC; Min Operating Temperature: -55°C; Packaging: Tape and Reel
L1 = CMP-05439-000004-1: FIXED IND 1.5UH 8.1A 13.2 MOHM; Manufacturer: Panasonic; Rms Current: 6.7A; Shielding: true; Series Resistance: 13.2mΩ; Core Material: Metal Composite; Saturation Current: 12A; Tolerance: 20%; Automotive Grade: Grade 0; Standoff Height: 0.05mm; Test Frequency: 100kHz; Category: Ind; Temperature Range Low: -55°C; Mouser Description: Power Choke Shielded Wirewound 1.5uH 20% 100KHz Metal 8.1A 0.0132Ohm DCR Automotive T/R; Octopart: https://octopart.com/etq-p3m1r5kvp-panasonic-74144444; ComponentLink2URL: https://industrial.panasonic.com/cdbs/www-data/pdf/AGL0000/AGL0000C63.pdf; Inductance: 1.5uH; Temperature: -55°C to +155°C; Lead Free: Yes; Device Class L3: Fixed Inductors; RoHS: TRUE; Device Class L2: Inductors; Manufacturer Part Number: ETQP3M1R5KVP; Temperature Range High: +155°C; Digikey Description: FIXED IND 1.5UH 8.1A 13.2 MOHM; Package: PCC-M0530M-LP; Device Class L1: Passive Components; ComponentLink2Description: Datasheet; Automotive: Yes; Height: 3mm
L2 = CDRH104RNP-2R5NC: FIXED IND 2.5UH 6.1A 10.5 MOHM
Q1-Q4 = CMP-04962-000055-1: MOSFET N-CH 30V 35A 8VSON; Rise Time: 5ns; Fall Time: 1ns; Max Power Dissipation: 3.2W; Turn-On Delay Time: 2ns; Rds On Max: 10.2mR; Turn-Off Delay Time: 11ns; Gate to Source Voltage (Vgs): 20V; Continuous Drain Current (ID): 20A; Element Configuration: Single; Input Capacitance: 998pF; Packaging: Tape and Reel; Lead Free: Lead Free; Min Operating Temperature: -55°C; Number of Pins: 8; Contact Plating: Copper; Mount: Surface Mount; RoHS Compliant: Yes; Drain to Source Voltage (Vdss): 30V; Max Operating Temperature: 150°C
R11 = CMP-08839-029062-1: 750Ω ±5% 0.25W 0603 Anti-Surge Chip Resistor AEC-Q200; Max Power Dissipation: 250mW; Temperature Coefficient: 200ppm/°C; Length: 0.063inch; Features: Automotive AEC-Q200; Min Operating Temperature: -55°C; Tolerance: 5%; Case Code (Imperial): 0603; Case Code (Metric): 1608; RoHS Compliant: Yes; Width: 0.032inch; Number of Terminations: 2; Resistor Type: Thick Film; Height - Seated (Max): 0.022inch; Max Operating Temperature: 155°C; Series: ESR; Package Quantity: 1; Packaging: Tape and Reel; Height: 0.022inch
R12 = CMP-26527-006784-1: as R3 on sheet Processor; RoHS Compliant: Yes; Height: 0.022inch; Resistor Type: Thick Film; Case Code (Metric): 1608; Radiation Hardening: No; Contact Plating: Tin; Series: RMCF; Features: Automotive AEC-Q200; Number of Terminations: 2; Tolerance: 1%; Packaging: Tape and Reel; Max Operating Temperature: 155°C; Min Operating Temperature: -55°C; Length: 0.061inch; Lead Free: Lead Free; Width: 0.031inch; Mount: Surface Mount; Case Code (Imperial): 0603
R13 = CMP-03412-011629-2: RES 100Ω 1.00% 0.1W 0603; Tolerance: 1%; RoHS Compliant: Yes
R17 R18 = RC0603FR-0710KL: RES SMD 10kO 1% 1/10W 0603; Manufacturer_Name: Yageo; R: 10k; Copyright: Copyright (C) 2025 Ultra Librarian. All rights reserved.; Manufacturer_Part_Number: RC0603FR-0710KL
R19 R20 = RC0603FR-0710KL: RES SMD 10kO 1% 1/10W 0603; Manufacturer_Name: Yageo; Copyright: Copyright (C) 2025 Ultra Librarian. All rights reserved.; Manufacturer_Part_Number: RC0603FR-0710KL
R21 = RNCF0603BTE2K50: RES SMD 2.5K OHM 0.1% 1/6W 0603; Manufacturer_Name: Stackpole International; Copyright: Copyright (C) 2025 Ultra Librarian. All rights reserved.; Manufacturer_Part_Number: RNCF0603BTE2K50
R22-R26 R28 = CMP-26527-005040-1: 10Ω ±1% 0.1W 0603 Thick Film Chip Resistor AEC-Q200 compliant; Max Power Dissipation: 100mW; Temperature Coefficient: 100ppm/°C; Radiation Hardening: No; Military Standard: Not; Resistor Type: Thick Film; Case/Package: 0603; Case Code (Metric): 1608; Power Rating: 100mW; Min Operating Temperature: -55°C; Mount: Surface Mount; Width: 0.031inch; Packaging: Tape and Reel; Tolerance: 1%; Case Code (Imperial): 0603; Number of Terminations: 2; Height: 0.022inch; Features: Automotive AEC-Q200; Construction: Rectangular; Contact Plating: Tin; RoHS Compliant: Yes; Length: 1.55mm; Max Operating Temperature: 155°C; Depth: 0.8mm; Series: RMCF
R27 R29 = CMP-02407-000603-1: RES SMD 100 OHM 1% 1/8W 0603; Resistance: 4.02kR; Voltage Rating: 75V; Tolerance: 0.1%; Power Rating: 125mW; Packaging: Tape and Reel; Width: 0.85mm; Length: 1.55mm; Composition: Thin Film; Max Operating Temperature: 155°C; Min Operating Temperature: -55°C; Case/Package: 0603; Case Code (Metric): 1608; Case Code (Imperial): 0603; Height: 0.45mm; Weight: 6.7E-05oz
R30 R31 = CMP-2000-06932-2: RES 20K OHM 1% 1/10W 0603; Voltage Rating: 50V; Temperature Coefficient: 100ppm/°C; Power Rating: 100mW; Height: 0.022inch; REACH SVHC: No SVHC; Case Code (Metric): 1608; Depth: 0.8mm; Tolerance: 1%; Min Operating Temperature: -55°C; Series: RC; RoHS Compliant: Yes; Resistor Type: Thick Film; Max Power Dissipation: 100mW; Features: Moisture Resistant; Max Operating Temperature: 155°C; Package Quantity: 1; Size Code: 0603; Packaging: Tape and Reel; Width: 0.031inch; Length: 0.063inch; Military Standard: Not; Technology: THICK FILM; Number of Terminations: 2; Termination: SMD/SMT; Construction: Rectangular; Case/Package: 0603; Number of Pins: 2; Lead Free: Lead Free; Voltage Rating (DC): 50V; Resistance Tolerance: 1%; Case Code (Imperial): 0603
U2 = LM5143QRWGRQ1: 3.5-V to 65-V low Iq, dual, 2-phase synchronous buck DC-DC controller 40-VQFNP -40 to 150; Manufacturer_Name: Texas Instruments; TYPE: TYPE; RefDes: RefDes; Copyright: Copyright (C) 2026 Ultra Librarian. All rights reserved.; Manufacturer_Part_Number: LM5143QRWGRQ1; Datasheet: https://www.ti.com/lit/gpn/lm5143-q1
U3 = CMP-0192-00220-1: Low-Power Linear Active Thermistor IC, 3-Pin SOT-23, Extended Temperature, Tape and Reel; DatasheetVersion: revE, Apr-2009; PackageVersion: revBB, Aug-2009; PackageReference: SOT-23-TT3; Code_IPC: SOT23-3; PackageDescription: 3-Lead Plastic Small Outline Transistor (TT) [SOT-23]

## Sheet microSD.SchDoc
size A4; SheetNumber: 5; SheetTotal: 5
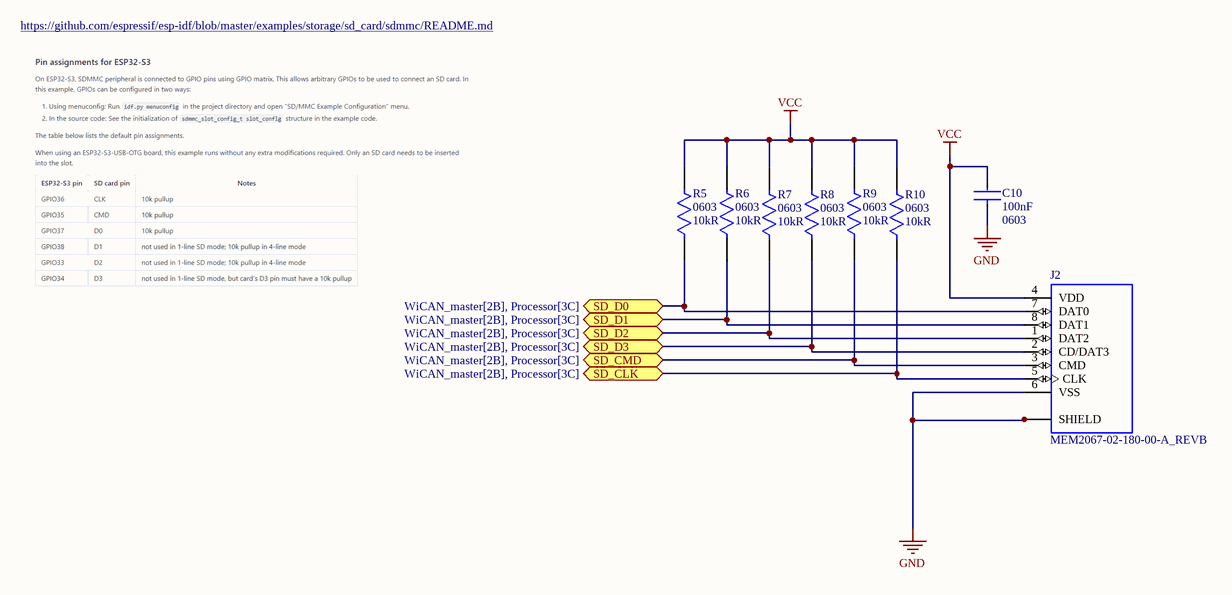
[diagram p3: microSD.SchDoc]

### Parts
C10  Capacitance: 100nF  Case/Package: 0603  [FP-CL10-IPC_A]  (hidden comment: CL10B104KB8WPNC)
J2  MEM2067-02-180-00-A_REVB  [GCT_MEM2067-02-180-00-A_REVB]
R5  Case Code (Imperial): 0603  Resistance: 10kR  [FP-RMCF0603-MFG]  (hidden comment: RMCF0603JG10K0)
R6  Case Code (Imperial): 0603  Resistance: 10kR  [FP-RMCF0603-MFG]  (hidden comment: RMCF0603JG10K0)
R7  Case Code (Imperial): 0603  Resistance: 10kR  [FP-RMCF0603-MFG]  (hidden comment: RMCF0603JG10K0)
R8  Case Code (Imperial): 0603  Resistance: 10kR  [FP-RMCF0603-MFG]  (hidden comment: RMCF0603JG10K0)
R9  Case Code (Imperial): 0603  Resistance: 10kR  [FP-RMCF0603-MFG]  (hidden comment: RMCF0603JG10K0)
R10  Case Code (Imperial): 0603  Resistance: 10kR  [FP-RMCF0603-MFG]  (hidden comment: RMCF0603JG10K0)

### Ports
SD_CLK (bidir, see WiCAN_master[2B], Processor[3C]), SD_CMD (bidir, see WiCAN_master[2B], Processor[3C]), SD_D0 (bidir, see WiCAN_master[2B], Processor[3C]), SD_D1 (bidir, see WiCAN_master[2B], Processor[3C]), SD_D2 (bidir, see WiCAN_master[2B], Processor[3C]), SD_D3 (bidir, see WiCAN_master[2B], Processor[3C])

### Nets
GND: C10.1 J2.6(VSS) J2.9(SHIELD) J2.10(SHIELD) J2.11(SHIELD) J2.12(SHIELD)
VCC: C10.2 J2.4(VDD) R5.2 R6.2 R7.2 R8.2 R9.2 R10.2
NetJ2_1: J2.1(DAT2) R7.1 ; port SD_D2
NetJ2_2: J2.2(CD/DAT3) R8.1 ; port SD_D3
NetJ2_3: J2.3(CMD) R9.1 ; port SD_CMD
NetJ2_5: J2.5(CLK) R10.1 ; port SD_CLK
NetJ2_7: J2.7(DAT0) R5.1 ; port SD_D0
NetJ2_8: J2.8(DAT1) R6.1 ; port SD_D1

### Notes on the sheet
- https://github.com/espressif/esp-idf/blob/master/examples/storage/sd_card/sdmmc/README.md

### Library data of the parts
C10 = CMP-13271-002353-1: as C1 on sheet Processor; Ratings: AEC-Q200; Features: Soft Termination; Max Operating Temperature: 125°C; Mount: Surface Mount; Width: 0.031inch; Voltage Rating: 50V; Case Code (Metric): 1608; Case Code (Imperial): 0603; Tolerance: 10%; Min Operating Temperature: -55°C; Thickness: 0.035inch; Lead Free: Lead Free; Packaging: Tape and Reel; Length: 0.063inch
J2 = MEM2067-02-180-00-A_REVB: Micro SD Memory Card ConnectorSMT, Hinged, 1.80mm Profile; Value: *; MP: MEM2067-02-180-00-A_REVB; Package: None; Availability: Unavailable; Price: None
R5-R10 = CMP-26527-000153-1: as R1 on sheet Processor; Tolerance: 5%; Series: RMCF; Resistor Type: Thick Film; Length: 0.061inch; Features: Automotive AEC-Q200; Height: 0.022inch; Case Code (Metric): 1608; Width: 0.031inch; Number of Terminations: 2; Contact Plating: Tin; Case/Package: 0603; Package Quantity: 1; Max Operating Temperature: 155°C; Mount: Surface Mount; RoHS Compliant: Yes; Radiation Hardening: No; Min Operating Temperature: -55°C; Packaging: Tape and Reel

## Sheet CAN.SchDoc
size A4; SheetNumber: 4; SheetTotal: 5
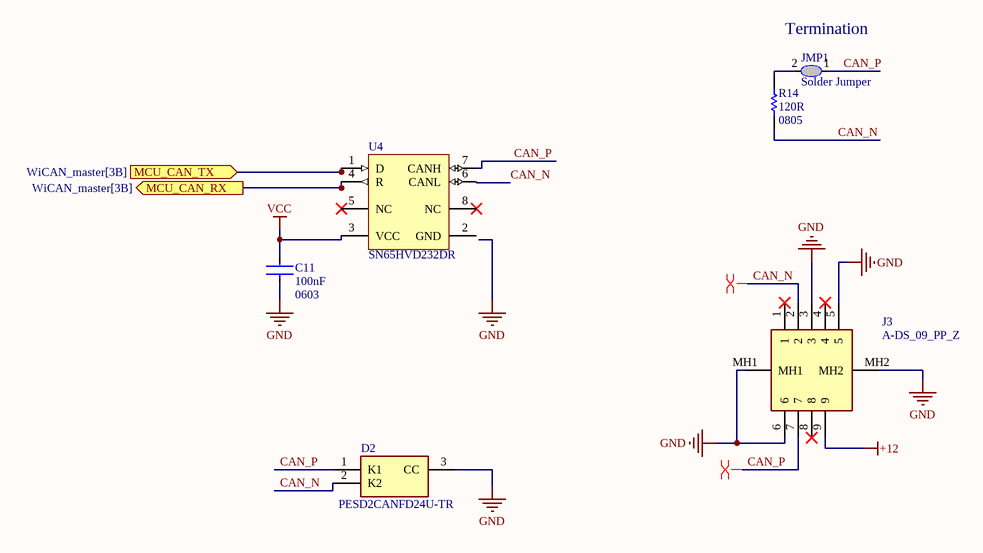
[diagram p4: CAN.SchDoc]

### Parts
C11  Capacitance: 100nF  Case/Package: 0603  [FP-CL10-IPC_A]  (hidden comment: CL10B104KB8WPNC)
D2  PESD2CANFD24U-TR  [SOT95P230X110-3N]
J3  A-DS_09_PP_Z  [ADS09PPZ]
JMP1  Solder Jumper  [Solder Jumper]
R14  Resistance: 120R  Package: 0805  [RESC2013X70X40LL20T20]  (hidden comment: ERJ-P06J121V)
U4  SN65HVD232DR  [D0008A_M]

### Ports
MCU_CAN_RX (out, see WiCAN_master[3B]), MCU_CAN_TX (in, see WiCAN_master[3B])

### Nets
+12: J3.9
GND: C11.1 D2.3(CC) J3.3 J3.5 J3.6 J3.MH1 J3.MH2
VCC: C11.2 U4.3(VCC)
CAN_N: D2.2(K2) J3.2 R14.2 U4.6(CANL)
CAN_P: D2.1(K1) J3.7 JMP1.1 U4.7(CANH)
NetJMP1_2: JMP1.2 R14.1
NetU1_20: U4.1(D) ; port MCU_CAN_TX
NetU1_21: U4.4(R) ; port MCU_CAN_RX

Not connected (* = marked no-connect by the designer): J3 1* 4* 8*; U4 2(GND) 5(NC)* 8(NC)*

### Layout directives
differential pair: CAN_N, CAN_P

### Notes on the sheet
- Termination

### Library data of the parts
C11 = CMP-13271-002353-1: as C1 on sheet Processor; Ratings: AEC-Q200; Features: Soft Termination; Max Operating Temperature: 125°C; Mount: Surface Mount; Width: 0.031inch; Voltage Rating: 50V; Case Code (Metric): 1608; Case Code (Imperial): 0603; Tolerance: 10%; Min Operating Temperature: -55°C; Thickness: 0.035inch; Lead Free: Lead Free; Packaging: Tape and Reel; Length: 0.063inch
D2 = PESD2CANFD24U-TR: Diode; Manufacturer_Name: Nexperia; Datasheet Link: https://assets.nexperia.com/documents/data-sheet/PESD2CANFD24U-T.pdf; Height: 1.1mm; Manufacturer_Part_Number: PESD2CANFD24U-TR; Mouser Part Number: 771-PESD2CANFD24U-TR; Mouser Price/Stock: https://www.mouser.co.uk/ProductDetail/Nexperia/PESD2CANFD24U-TR?qs=vmHwEFxEFR%252BPr2so13o7KA%3D%3D; Arrow Part Number: PESD2CANFD24U-TR; Arrow Price/Stock: https://www.arrow.com/en/products/pesd2canfd24u-tr/nexperia
J3 = A-DS_09_PP_Z: Connector; Manufacturer_Name: ASSMANN WSW components GmbH; Manufacturer_Part_Number: A-DS 09 PP/Z; Datasheet Link: https://datasheet.datasheetarchive.com/originals/distributors/DKDS-12/220555.pdf; Height: 12.35mm
R14 = CMP-2001-00481-1: Manufacturer: Panasonic; Part Number: ERJ-P06J121V
U4 = CMP-0315-00075-2: 3.3 V Can Transceiver, 17 mA, -40 to 85 degC, 8-pin SOIC (D), Green (RoHS & no Sb/Br); Manufacturer: Texas Instruments; Supply Voltage(s)(V): 3.3; Receivers Per Package: 1; ICC(Max)(mA): 17; Rating: Catalog; Transient Pulse Protection(V): -25 to 25; Mounting Technology: Surface Mount; PartNumber: SN65HVD232DR; Code_JEDEC: MS-012AA; Eco-Plan: Green (RoHS & no Sb/Br); Isolated: No; SubFamily: CAN; Footprint: SN65HVD232; Drivers Per Package: 1; ComponentLink1URL: http://www.ti.com/general/docs/lit/getliterature.tsp?genericPartNumber=SN65HVD232&fileType=pdf; ComponentLink1Description: Datasheet; PackageDescription: 8-Pin Plastic Small Outline Integrated Circuit, 4.9 x 3.9 mm, Pitch 1.27 mm Pitch; PackageReference: D0008A; DatasheetVersion: SLOS346K; PackageVersion: revM, Jun-2011

## Sheet BackupPower.SchDoc
size A4; SheetNumber: 6; SheetTotal: 6
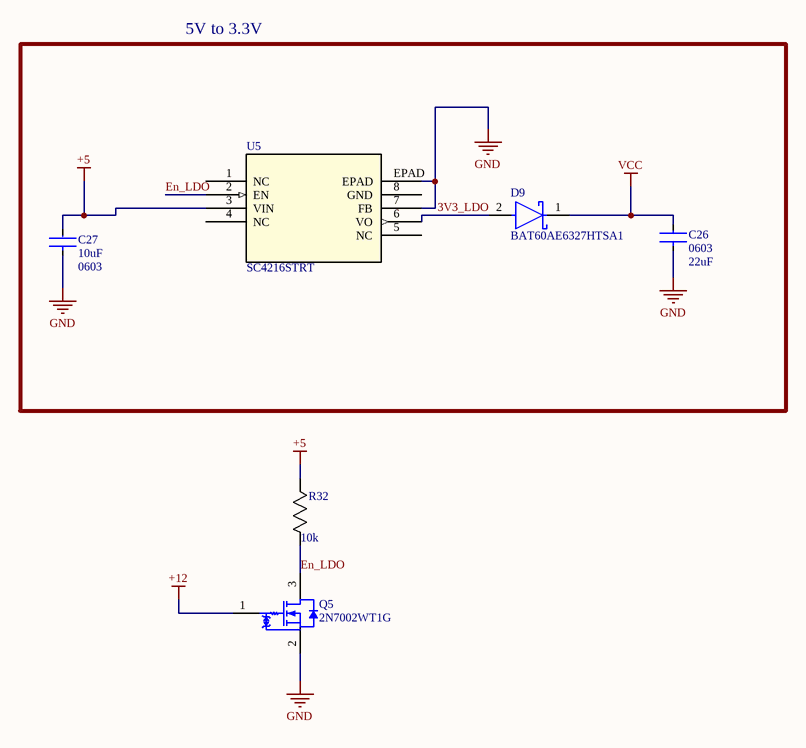
[diagram p5: BackupPower.SchDoc]

### Parts
C26  Case/Package: 0603  Capacitance: 22uF  [FP-GRM188-0_2-MFG]  (hidden comment: GRM188R60G226MEA0D)
C27  Capacitance: 10uF  Case/Package: 0603  [FP-CL10-IPC_C]  (hidden comment: CL10A106MQ8NNNC)
D9  BAT60AE6327HTSA1  [FP-PG-SOD323-2-IPC_C]
Q5  2N7002WT1G  [ONSC-SC-70-3-419-04_V]
R32  R: 10k  [RC0603N_YAG]  (hidden comment: RC0603FR-0710KL)
U5  SC4216STRT  [SOIC-8-EDP_SEM]

### Blocks framed on the sheet
5V to 3.3V: C26 C27 D9 U5

### Nets
+5: C27.2 R32.2 U5.3(VIN)
+12: Q5.1(G)
GND: C26.1 C27.1 Q5.2(S) U5.7(FB) U5.EPAD
VCC: C26.2 D9.1(C)
3V3_LDO: D9.2(A) U5.6(VO)
En_LDO: Q5.3(D) R32.1 U5.2(EN)

Not connected (* = marked no-connect by the designer): U5 1(NC) 4(NC) 5(NC) 8(GND)

### Library data of the parts
C26 = CMP-2006-02788-2: Chip Multilayer Ceramic Capacitors for General Purpose, 0603, 22uF, X5R, 15%, 20%, 4V; Package Quantity: 4000; Lead Free: Lead Free; Material: Ceramic; Height: 0.8mm; Length: 1.6mm; REACH SVHC: No SVHC; Voltage Rating: 4V; Depth: 0.8mm; Case Code (Metric): 1608; Voltage: 4V; Dielectric: X5R; Width: 0.8mm; Max Operating Temperature: 85°C; Tolerance: 20%; Packaging: Tape and Reel; Case Code (Imperial): 0603; Voltage Rating (DC): 4V; Thickness: 0.035inch; Mount: Surface Mount; Min Operating Temperature: -55°C; Radiation Hardening: No; Termination: SMD/SMT
C27 = CMP-13271-001938-1: Cap Ceramic 10uF 6.3V X5R ±20% Pad SMD 0603 +85°C T/R; Contact Plating: Tin; Height: 0.8mm; Width: 0.031inch; Min Operating Temperature: -55°C; Dielectric: X5R; Voltage Rating: 6.3V; Package Quantity: 1; Radiation Hardening: No; Packaging: Tape and Reel; Max Operating Temperature: 85°C; Voltage: 6.3V; Thickness: 0.035inch; Mount: Surface Mount; Case Code (Imperial): 0603; Case Code (Metric): 1608; Depth: 0.8mm; Tolerance: 20%; Length: 1.6mm
D9 = CMP-32890-000004-1: as D6 on sheet Power; Max Operating Temperature: 85°C; Current Rating: 3A; Number of Pins: 2; Mount: Surface Mount; Forward Current: 3A; Max Reverse Voltage (DC): 10V; Output Current: 3A; Contact Plating: Tin; Average Rectified Current: 3A; Lead Free: Lead Free; Max Repetitive Reverse Voltage (Vrrm): 10V; Voltage Rating (DC): 10V; Radiation Hardening: No; Halogen Free: Not Halogen Free; Case/Package: SOD-323-2; REACH SVHC: No SVHC; Min Operating Temperature: -55°C; Packaging: Tape and Reel
Q5 = CMP-1058-00618-1: Small Signal MOSFET, 60 V, 340 mA, Single, N-Channel, 3-Pin SC70, Pb-Free, Tape and Reel; Manufacturer: On Semiconductor; Crss Typ (pF): 2.2; Coss Typ (pF): 4.2; VGS(th) Max (V): 2.5; Channel Polarity: N Channel; ID Max (A): 0.34; VGS Max (V): 20; V(BR)DSS Min (V): 60; Ciss Typ (pF): 24.5; Configuration: Single; Packing: Tape and Reel; Package Type: SC-70-3 / SOT-323-3; RoHS: Pb-Free; ComponentLink3Description: Package Specification; PackageReference: SC-70-3-419-04; Mounting Technology: Surface Mount; PackageVersion: Rev. N, 11/2008; ComponentLink2URL: http://www.onsemi.com/pub_link/Collateral/2N7002W-D.PDF; PartNumber: 2N7002WT1G; ComponentLink2Description: Datasheet; ComponentLink3URL: http://www.onsemi.cn/pub_link/Collateral/419-04.PDF; ComponentLink1Description: Manufacturer URL; ComponentLink1URL: http://www.onsemi.com/; DatasheetVersion: Rev. 5; PackageDescription: 3-Pin Small Outline Transistor, Body 2 x 1.25 mm, Pitch 0.65 mm
R32 = RC0603FR-0710KL: as R19 on sheet Power; Copyright: Copyright (C) 2025 Ultra Librarian. All rights reserved.; Manufacturer_Part_Number: RC0603FR-0710KL
U5 = SC4216STRT: Linear Voltage Regulator IC Positive Adjustable (Fixed) 1 Output 3A 8-SOIC, EDP; Manufacturer_Name: Semtech; Copyright: Copyright (C) 2026 Ultra Librarian. All rights reserved.; Manufacturer_Part_Number: SC4216STRT; Digi-Key_Part_Number_1: SC4216STR-ND; Digi-Key_Part_Number_2: SC4216SCT-ND; Digi-Key_Part_Number_3: SC4216SDKR-ND; RefDes: RefDes; Type: Type

## Nets that join several sheets
+5: Processor (D1.1), Power (9 pins), BackupPower (C27.2 R32.2 U5.3)
+12: Power (10 pins), CAN (J3.9), BackupPower (Q5.1)
GND: Processor (24 pins), Power (41 pins), microSD (6 pins), CAN (7 pins), BackupPower (5 pins)
VCC: Processor (5 pins), Power (6 pins), microSD (8 pins), CAN (C11.2 U4.3), BackupPower (C26.2 D9.1)
MCU_Temp_In: Processor (C1.2 U1.7), Power (U3.2)
NetJ2_1: Processor (U1.33), microSD (J2.1 R7.1)
NetJ2_2: Processor (U1.32), microSD (J2.2 R8.1)
NetJ2_3: Processor (U1.31), microSD (J2.3 R9.1)
NetJ2_5: Processor (U1.30), microSD (J2.5 R10.1)
NetJ2_7: Processor (U1.29), microSD (J2.7 R5.1)
NetJ2_8: Processor (U1.28), microSD (J2.8 R6.1)
NetU1_20: Processor (U1.20), CAN (U4.1)
NetU1_21: Processor (U1.21), CAN (U4.4)